# Altium schematic sheet STM32.SchDoc
size A4
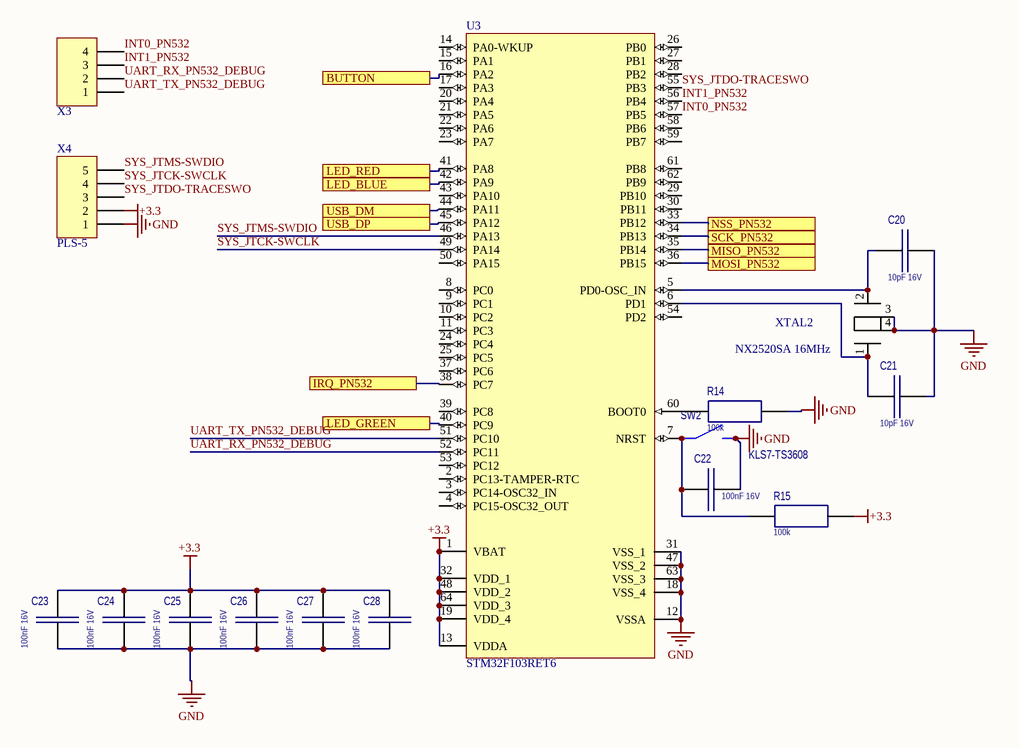
[diagram p0: STM32.SchDoc]

## Parts
C20  10pF 16V  [C_0805]
C21  10pF 16V  [C_0805]
C22  100nF 16V  [C_0805]
C23  100nF 16V  [C_0805]
C24  100nF 16V  [C_0805]
C25  100nF 16V  [C_0805]
C26  100nF 16V  [C_0805]
C27  100nF 16V  [C_0805]
C28  100nF 16V  [C_0805]
R14  100k  [R_0805]
R15  100k  [R_0805]
SW2  KLS7-TS3608  [KLS7-TS3611]
U3  STM32F103RET6  [LQFP64_L]
X3  PLS-4  [PLS-4-3D]  (value not drawn)
X4  PLS-5  [PLS-5-3D]
XTAL2  NX2520SA 16MHz  [NX2520SA]

## Ports
BUTTON, IRQ_PN532, LED_BLUE, LED_GREEN, LED_RED, MISO_PN532, MOSI_PN532, NSS_PN532, SCK_PN532, USB_DM, USB_DP

## Nets
+3.3: C23.1 C24.1 C25.1 C26.1 C27.1 C28.1 R15.1 U3.1(VBAT) U3.13(VDDA) U3.19(VDD_4) U3.32(VDD_1) U3.48(VDD_2) U3.64(VDD_3) X4.2
GND: C20.1 C21.1 C22.1 C23.2 C24.2 C25.2 C26.2 C27.2 C28.2 R14.1 SW2.2 U3.12(VSSA) U3.18(VSS_4) U3.31(VSS_1) U3.47(VSS_2) U3.63(VSS_3) X4.1 XTAL2.3 XTAL2.4
BUTTON: U3.16(PA2) ; port BUTTON
INT0_PN532: U3.57(PB5) X3.4
INT1_PN532: U3.56(PB4) X3.3
IRQ_PN532: U3.38(PC7) ; port IRQ_PN532
LED_BLUE: U3.42(PA9) ; port LED_BLUE
LED_GREEN: U3.40(PC9) ; port LED_GREEN
LED_RED: U3.41(PA8) ; port LED_RED
MISO_PN532: U3.35(PB14) ; port MISO_PN532
MOSI_PN532: U3.36(PB15) ; port MOSI_PN532
NSS_PN532: U3.33(PB12) ; port NSS_PN532
SCK_PN532: U3.34(PB13) ; port SCK_PN532
SYS_JTCK-SWCLK: U3.49(PA14) X4.4
SYS_JTDO-TRACESWO: U3.55(PB3) X4.3
SYS_JTMS-SWDIO: U3.46(PA13) X4.5
UART_RX_PN532_DEBUG: U3.52(PC11) X3.2
UART_TX_PN532_DEBUG: U3.51(PC10) X3.1
USB_DM: U3.44(PA11) ; port USB_DM
USB_DP: U3.45(PA12) ; port USB_DP
NetC20_2: C20.2 U3.5(PD0-OSC_IN) XTAL2.2
NetC21_2: C21.2 U3.6(PD1) XTAL2.1
NetC22_2: C22.2 R15.2 SW2.1 U3.7(NRST)
NetR14_2: R14.2 U3.60(BOOT0)

Not connected (* = marked no-connect by the designer): U3 2(PC13-TAMPER-RTC) 3(PC14-OSC32_IN) 4(PC15-OSC32_OUT) 8(PC0) 9(PC1) 10(PC2) 11(PC3) 14(PA0-WKUP) 15(PA1) 17(PA3) 20(PA4) 21(PA5) 22(PA6) 23(PA7) 24(PC4) 25(PC5) 26(PB0) 27(PB1) 28(PB2) 29(PB10) 30(PB11) 37(PC6) 39(PC8) 43(PA10) 50(PA15) 53(PC12) 54(PD2) 58(PB6) 59(PB7) 61(PB8) 62(PB9)

## Library data of the parts
C20-C28 = C0805: Capacitor
  C20 C21: Value: 10pF 16V
  C22-C28: Value: 100nF 16V
R14 R15 = R0805: Resistor; Value: 100k
SW2 = button
U3 = STM32F103RET6: STM32 ARM-based 32-bit MCU Performance Line with 512 kB Flash, 64 kB Internal RAM, -40 to +85°C Temperature, 64-Pin LQFP, Tray; DatasheetVersion: rev8.0, Apr-2011; PackageVersion: rev13, Apr-2011; PackageReference: LQFP64; PackageDescription: 64-Pin Low-Profile Quad Flat Pack, 10 x 10 mm Body, 0.5 mm Pitch (LQFP64); ComponentLink1Description: Manufacturer URL; ComponentLink1URL: http://www.st.com/; ComponentLink2Description: STM32F103 Datasheet; ComponentLink2URL: http://www.st.com/internet/com/TECHNICAL_RESOURCES/TECHNICAL_LITERATURE/DATASHEET/CD00191185.pdf; ComponentLink3Description: STM32 Family Web Page; ComponentLink3URL: www.st.com/stm32
X3 = PLS-4: Header, 4-Pin; LatestRevisionDate: 17-Jul-2002; LatestRevisionNote: Re-released for DXP Platform.; Publisher: Altium Limited
X4 = PLS-5: Header, 5-Pin; LatestRevisionDate: 17-Jul-2002; LatestRevisionNote: Re-released for DXP Platform.; Publisher: Altium Limited
XTAL2 = NX2520SA: Quartz; pin to pad: 2>3 3>2